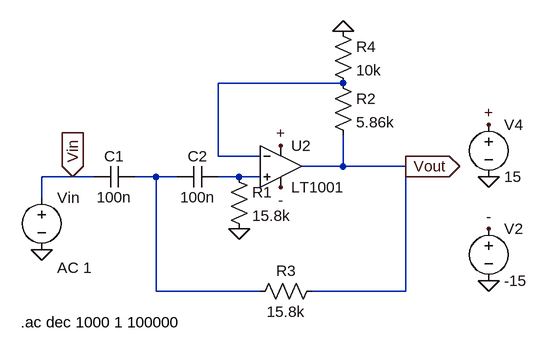
[diagram p0: schematic HPFDesign2_402101577.asc]
HPFDesign2_402101577.asc, the LTspice schematic file:
Version 4
SHEET 1 880 680
WIRE 304 16 112 16
WIRE 112 128 112 16
WIRE 176 128 112 128
WIRE 304 144 304 96
WIRE 304 144 240 144
WIRE 400 144 304 144
WIRE -112 160 -160 160
WIRE -80 160 -112 160
WIRE 16 160 -16 160
WIRE 48 160 16 160
WIRE 144 160 112 160
WIRE 176 160 144 160
WIRE -160 192 -160 160
WIRE 16 336 16 160
WIRE 176 336 16 336
WIRE 400 336 400 144
WIRE 400 336 256 336
FLAG -160 272 0
FLAG 144 240 0
FLAG 304 -64 0
FLAG 208 112 +
FLAG 528 80 +
FLAG 208 176 -
FLAG 528 240 -
FLAG 528 320 0
FLAG 528 160 0
FLAG 400 144 Vout
IOPIN 400 144 Out
FLAG -112 160 Vin
IOPIN -112 160 In
SYMBOL LT1001 208 80 R0
SYMATTR InstName U2
SYMBOL cap 112 144 R90
WINDOW 0 0 32 VBottom 2
WINDOW 3 32 32 VTop 2
SYMATTR InstName C2
SYMATTR Value 100n
SYMBOL cap -16 144 R90
WINDOW 0 0 32 VBottom 2
WINDOW 3 32 32 VTop 2
SYMATTR InstName C1
SYMATTR Value 100n
SYMBOL voltage -160 176 R0
WINDOW 123 24 124 Left 2
WINDOW 39 0 0 Left 0
SYMATTR Value2 AC 1
SYMATTR InstName Vin
SYMATTR Value ""
SYMBOL res 128 144 R0
SYMATTR InstName R1
SYMATTR Value 15.8k
SYMBOL res 272 320 R90
WINDOW 0 0 56 VBottom 2
WINDOW 3 32 56 VTop 2
SYMATTR InstName R3
SYMATTR Value 15.8k
SYMBOL res 288 -80 R0
SYMATTR InstName R4
SYMATTR Value 10k
SYMBOL res 288 0 R0
SYMATTR InstName R2
SYMATTR Value 5.86k
SYMBOL voltage 528 64 R0
WINDOW 123 0 0 Left 0
WINDOW 39 0 0 Left 0
SYMATTR InstName V4
SYMATTR Value 15
SYMBOL voltage 528 224 R0
WINDOW 123 0 0 Left 0
WINDOW 39 0 0 Left 0
SYMATTR InstName V2
SYMATTR Value -15
TEXT -192 384 Left 2 !.ac dec 1000 1 100000

The netlist it stands for:
* HPFDesign2_402101577.asc
XU2 N003 N001 + - Vout LT1001  ; pins In+ In- V+ V- OUT
C2 N003 N002 100n
C1 N002 Vin 100n
Vin Vin 0 AC 1
R1 N003 0 15.8k
R3 Vout N002 15.8k
R4 0 N001 10k
R2 N001 Vout 5.86k
V4 + 0 15
V2 - 0 -15
.ac dec 1000 1 100000
.lib LTC.lib
.backanno
.end